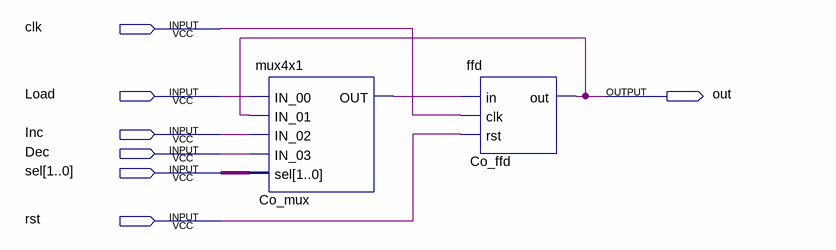
[diagram p0: schematic sheet]
// Quartus schematic block.bdf as structural Verilog: 2 symbols, 7 pins
module block (
  input  clk,
  input  Load,
  input  Inc,
  input  Dec,
  input  [1:0] sel,
  input  rst,
  output out
);

  wire Co_mux_out;

  mux4x1 Co_mux (.IN_00(Load), .IN_01(out), .IN_02(Inc), .IN_03(Dec), .sel(sel), .OUT(Co_mux_out));
  ffd Co_ffd (.in(Co_mux_out), .clk(clk), .rst(rst), .out(out));
endmodule
